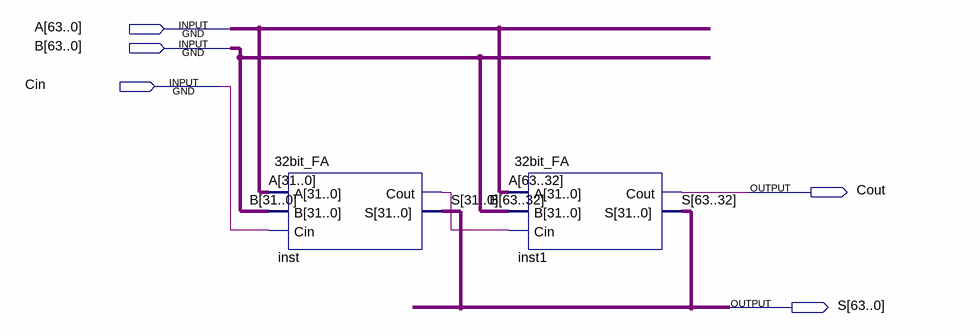
[diagram p0: schematic sheet]
// Quartus schematic 64bit_FA.bdf as structural Verilog: 2 symbols, 5 pins
module \64bit_FA  (
  input  [63:0] A,
  input  [63:0] B,
  input  Cin,
  output Cout,
  output [63:0] S
);

  wire inst_cout;

  \32bit_FA  inst (.A(A[31:0]), .B(B[31:0]), .Cin(Cin), .Cout(inst_cout), .S(S[31:0]));
  \32bit_FA  inst1 (.A(A[63:32]), .B(B[63:32]), .Cin(inst_cout), .Cout(Cout), .S(S[63:32]));
endmodule
